# Altium project ESP8266-01-Breakout.PrjPCB
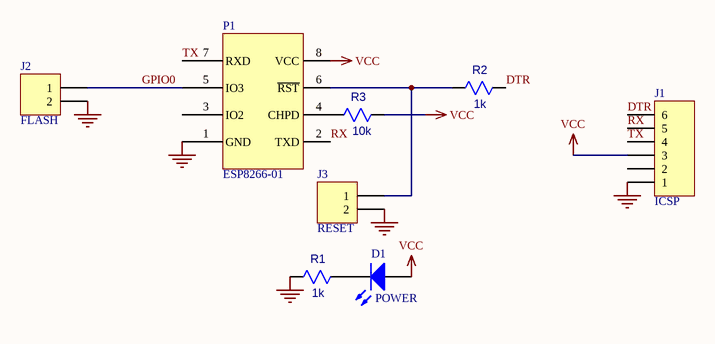
[diagram p0: ESP8266-01-Breakout.SchDoc]
1 sheet, 8 parts. Net scope: global (net labels, ports and power ports of the same name join across sheets).
Board file: ESP8266-01-Breakout.PcbDoc

## Sheet ESP8266-01-Breakout.SchDoc
size A

### Parts
D1  POWER  [3.2X1.6X1.1]
J1  ICSP  [HDR1X6]
J2  FLASH  [HDR1X2]
J3  RESET  [HDR1X2]
P1  ESP8266-01  [ESP8266-01]
R1  value 1k  [CAPC0805(2012)75_N]  (hidden comment: RES_0805)
R2  value 1k  [CAPC0805(2012)75_N]  (hidden comment: RES_0805)
R3  value 10k  [CAPC0805(2012)75_N]  (hidden comment: RES_0805)

### Nets
GND: J1.1 J2.2 J3.2 P1.1(GND) R1.2
VCC: D1.1(A) J1.3 P1.8(VCC) R3.1
DTR: J1.6 R2.1
GPIO0: J2.1 P1.5(IO3)
RX: J1.5 P1.2(TXD)
TX: J1.4 P1.7(RXD)
NetD1_2: D1.2(K) R1.1
NetJ3_1: J3.1 P1.6(~{RST}) R2.2
NetP1_4: P1.4(CHPD) R3.2

Not connected (* = marked no-connect by the designer): J1 2; P1 3(IO2)

### Library data of the parts
D1 = LED2: Typical RED, GREEN, YELLOW, AMBER GaAs LED; Published: 8-Jun-2000; LatestRevisionDate: 17-Jul-2002; LatestRevisionNote: Re-released for DXP Platform.; PackageVersion: Feb-2002; PackageReference: 3.2X1.6X1.1; Publisher: Altium Limited; PackageDescription: SM LED; 2 Flat Leads
J1 = Header 6: Header, 6-Pin; LatestRevisionDate: 17-Jul-2002; LatestRevisionNote: Re-released for DXP Platform.; Publisher: Altium Limited
J2 J3 = Header 2: Header, 2-Pin; LatestRevisionDate: 17-Jul-2002; LatestRevisionNote: Re-released for DXP Platform.; Publisher: Altium Limited